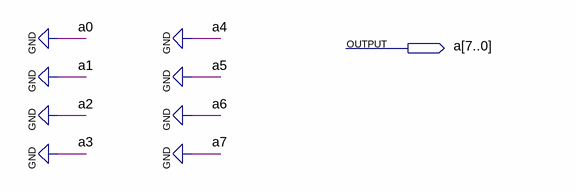
[diagram p0: schematic sheet]
// Quartus schematic gnd8bits.bdf as structural Verilog: 0 symbols, 1 pins
module gnd8bits (
  output [7:0] a
);


  assign a = {8{1'b0}};
endmodule
